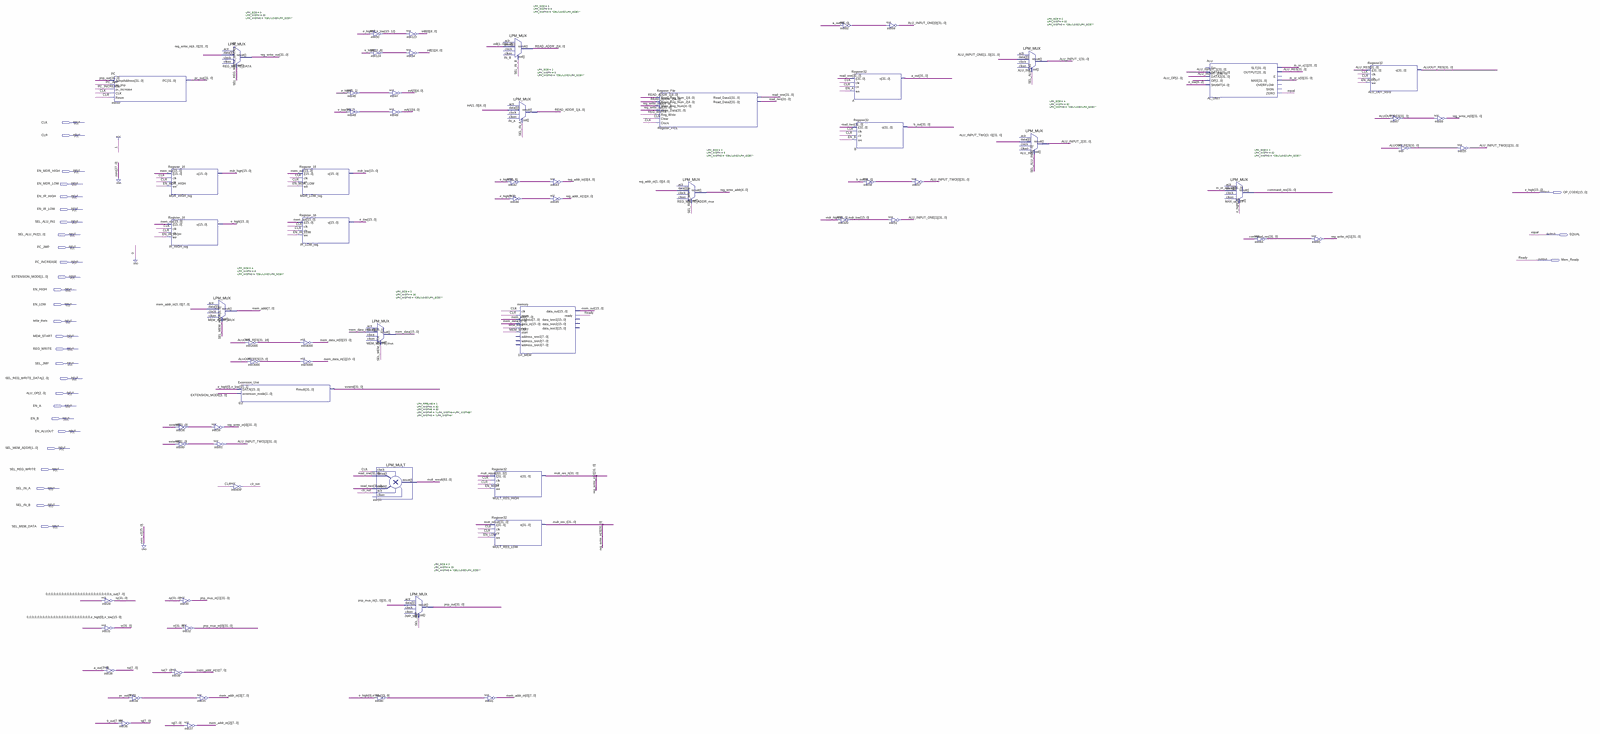
[diagram p0: schematic sheet, whole]
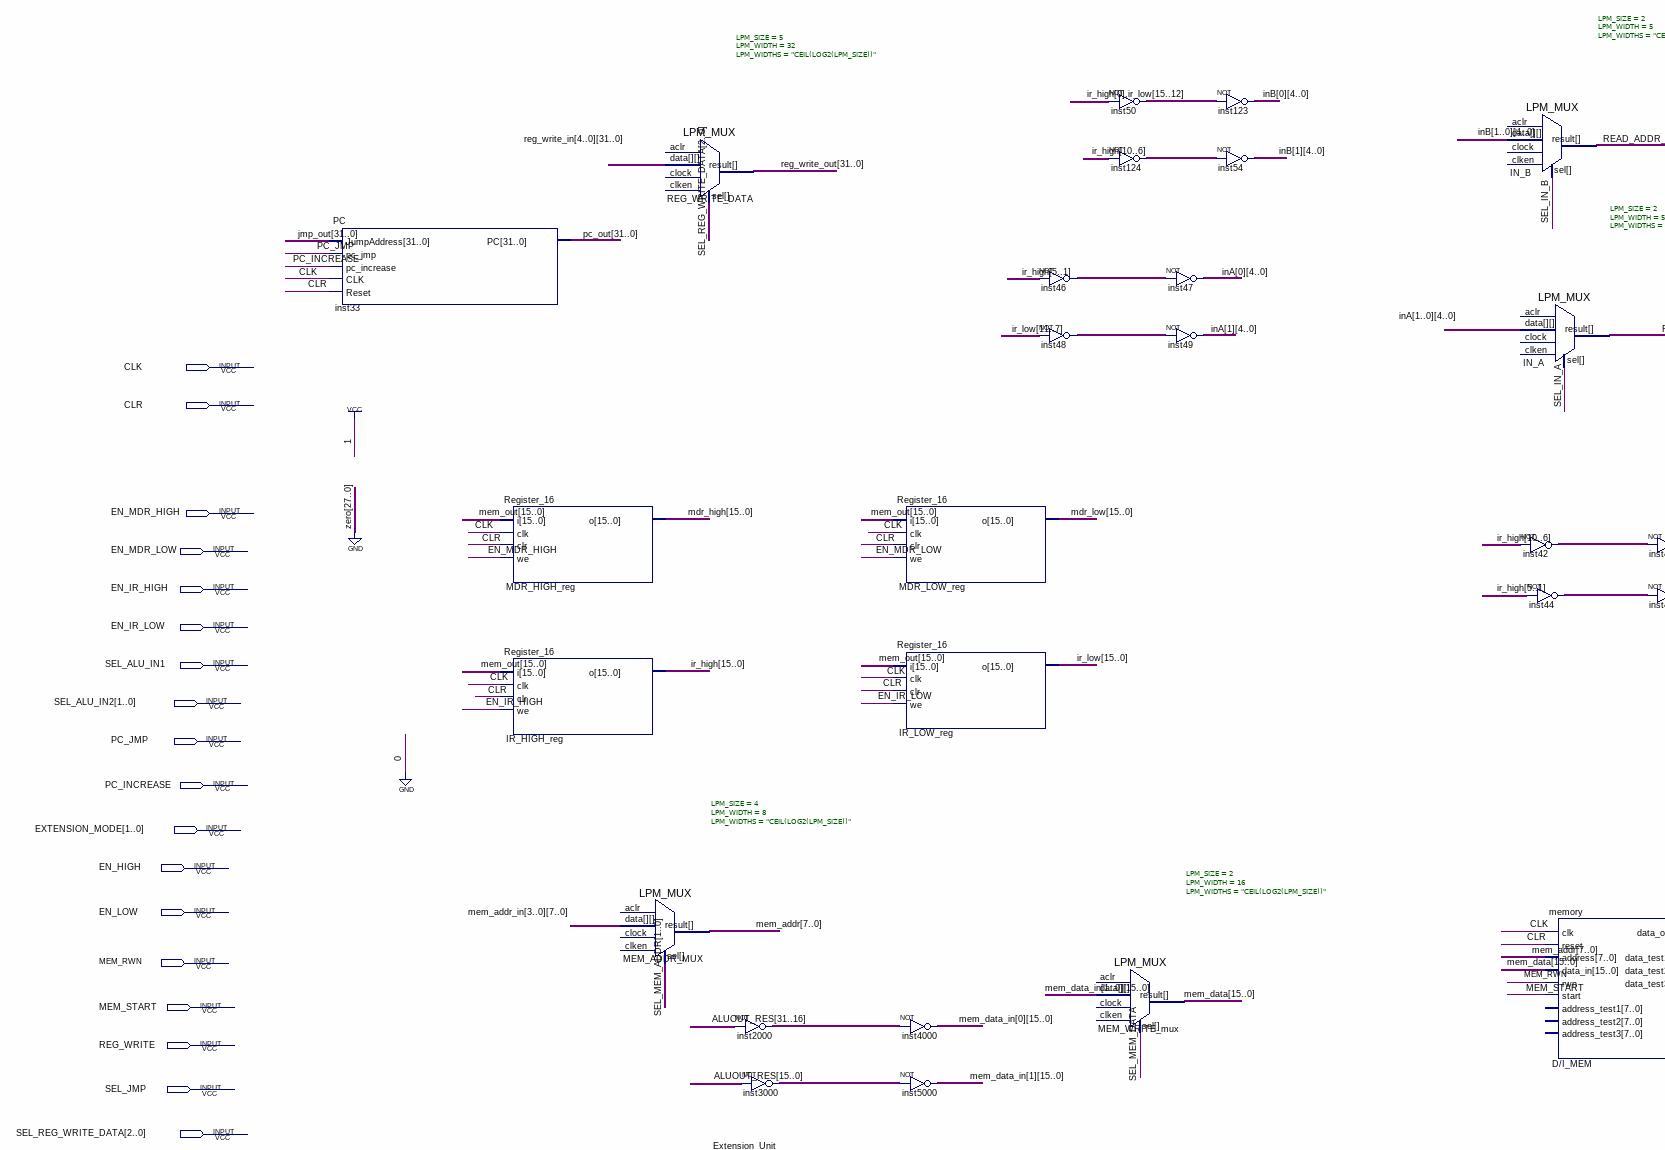
[diagram p1: schematic sheet, upper left part]
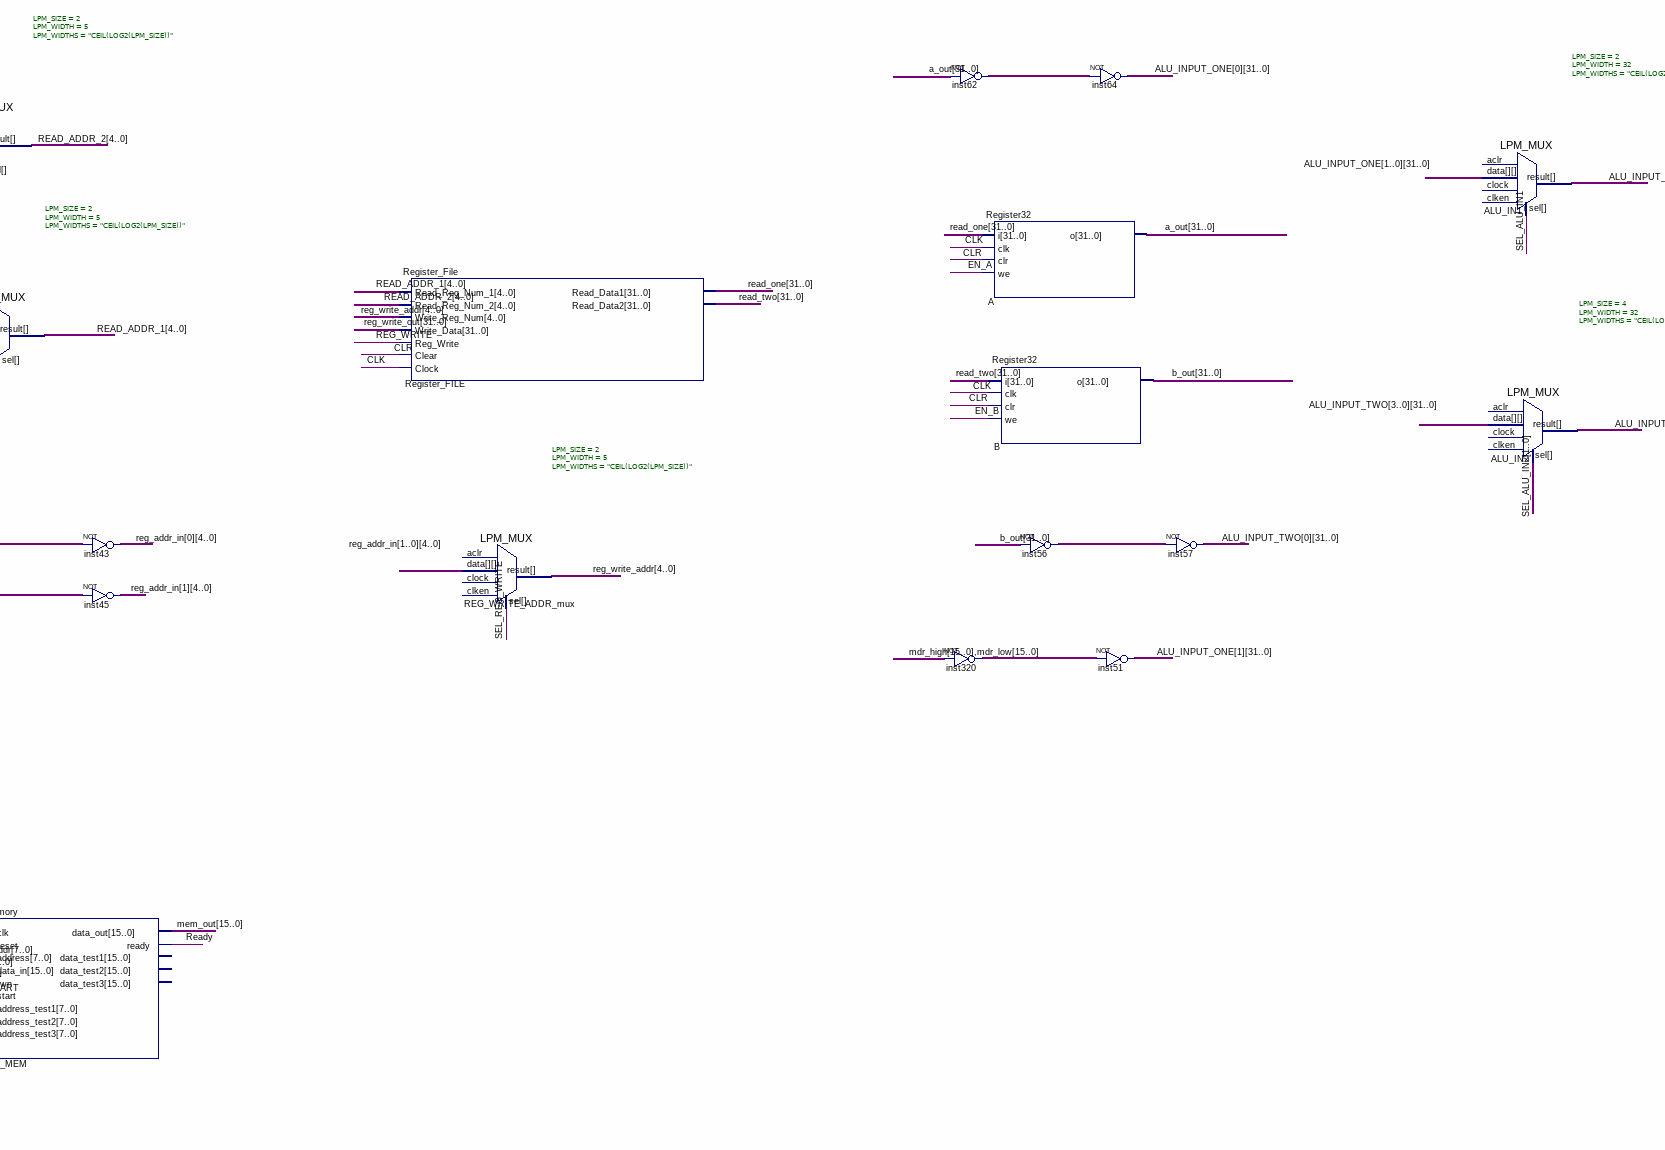
[diagram p2: schematic sheet, upper centre part]
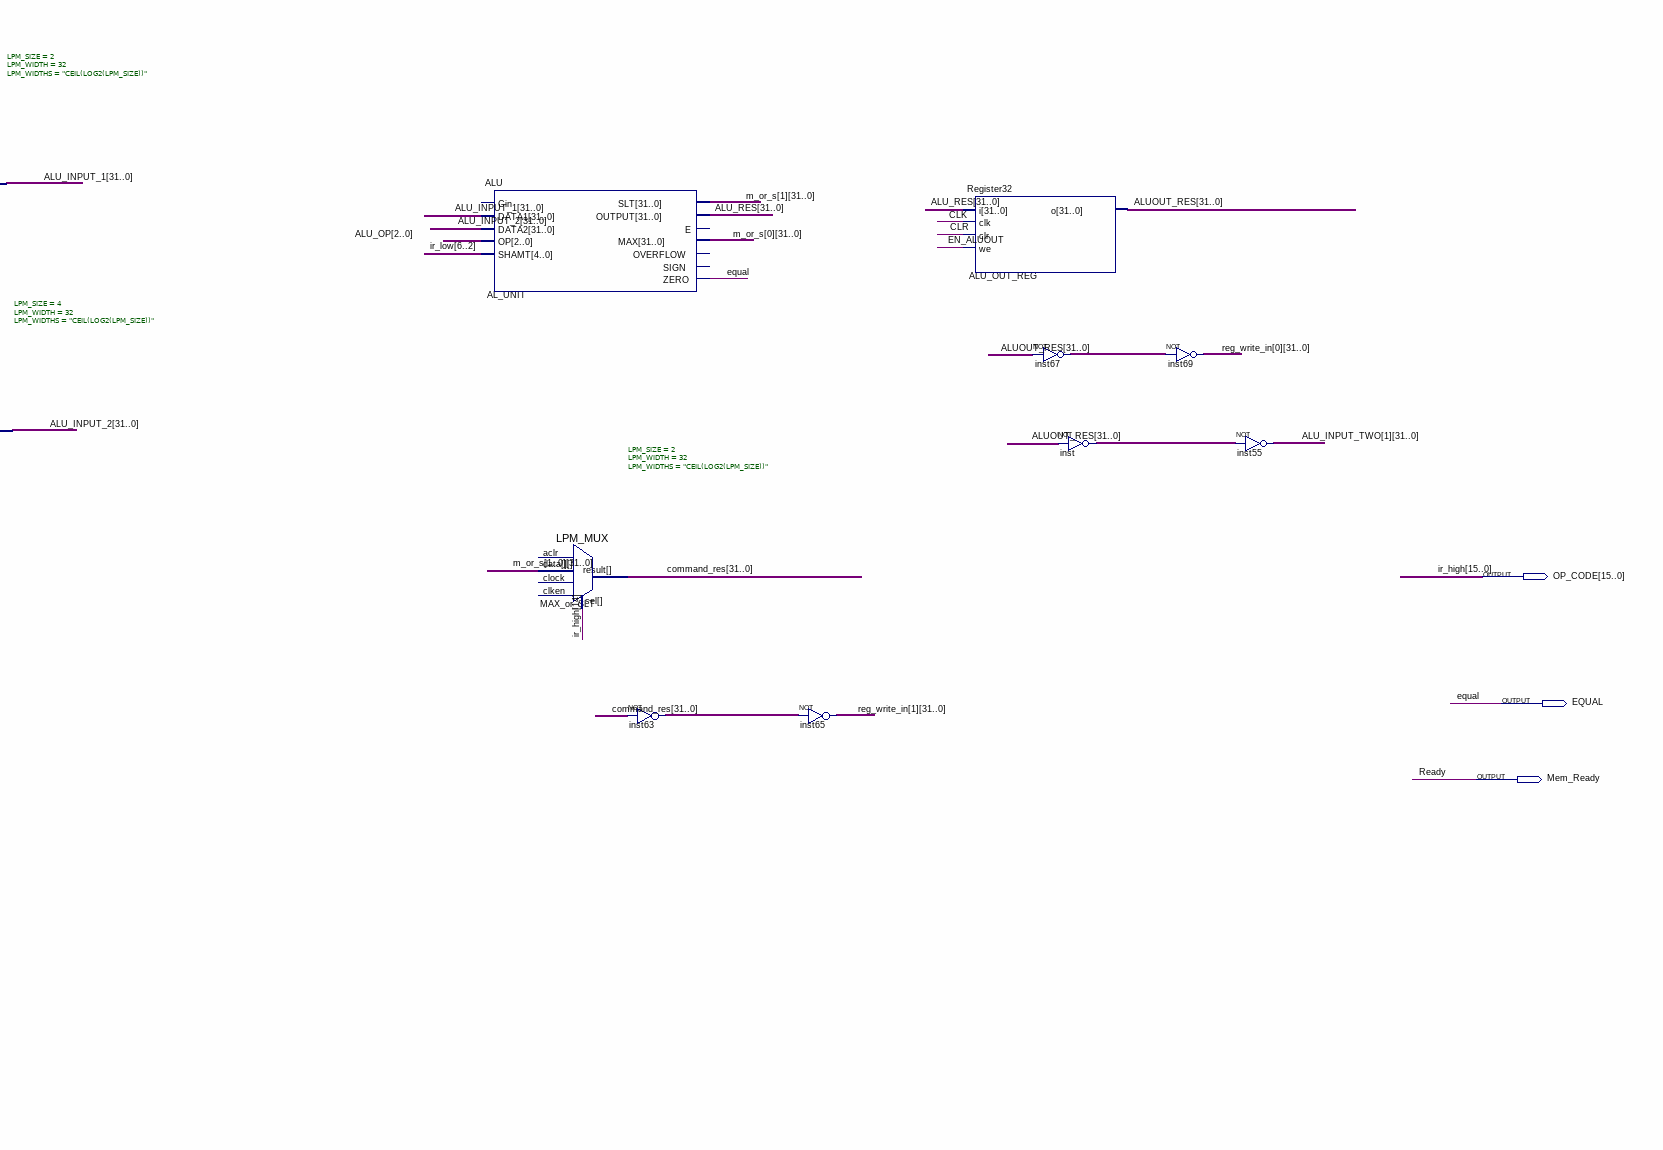
[diagram p3: schematic sheet, upper right part]
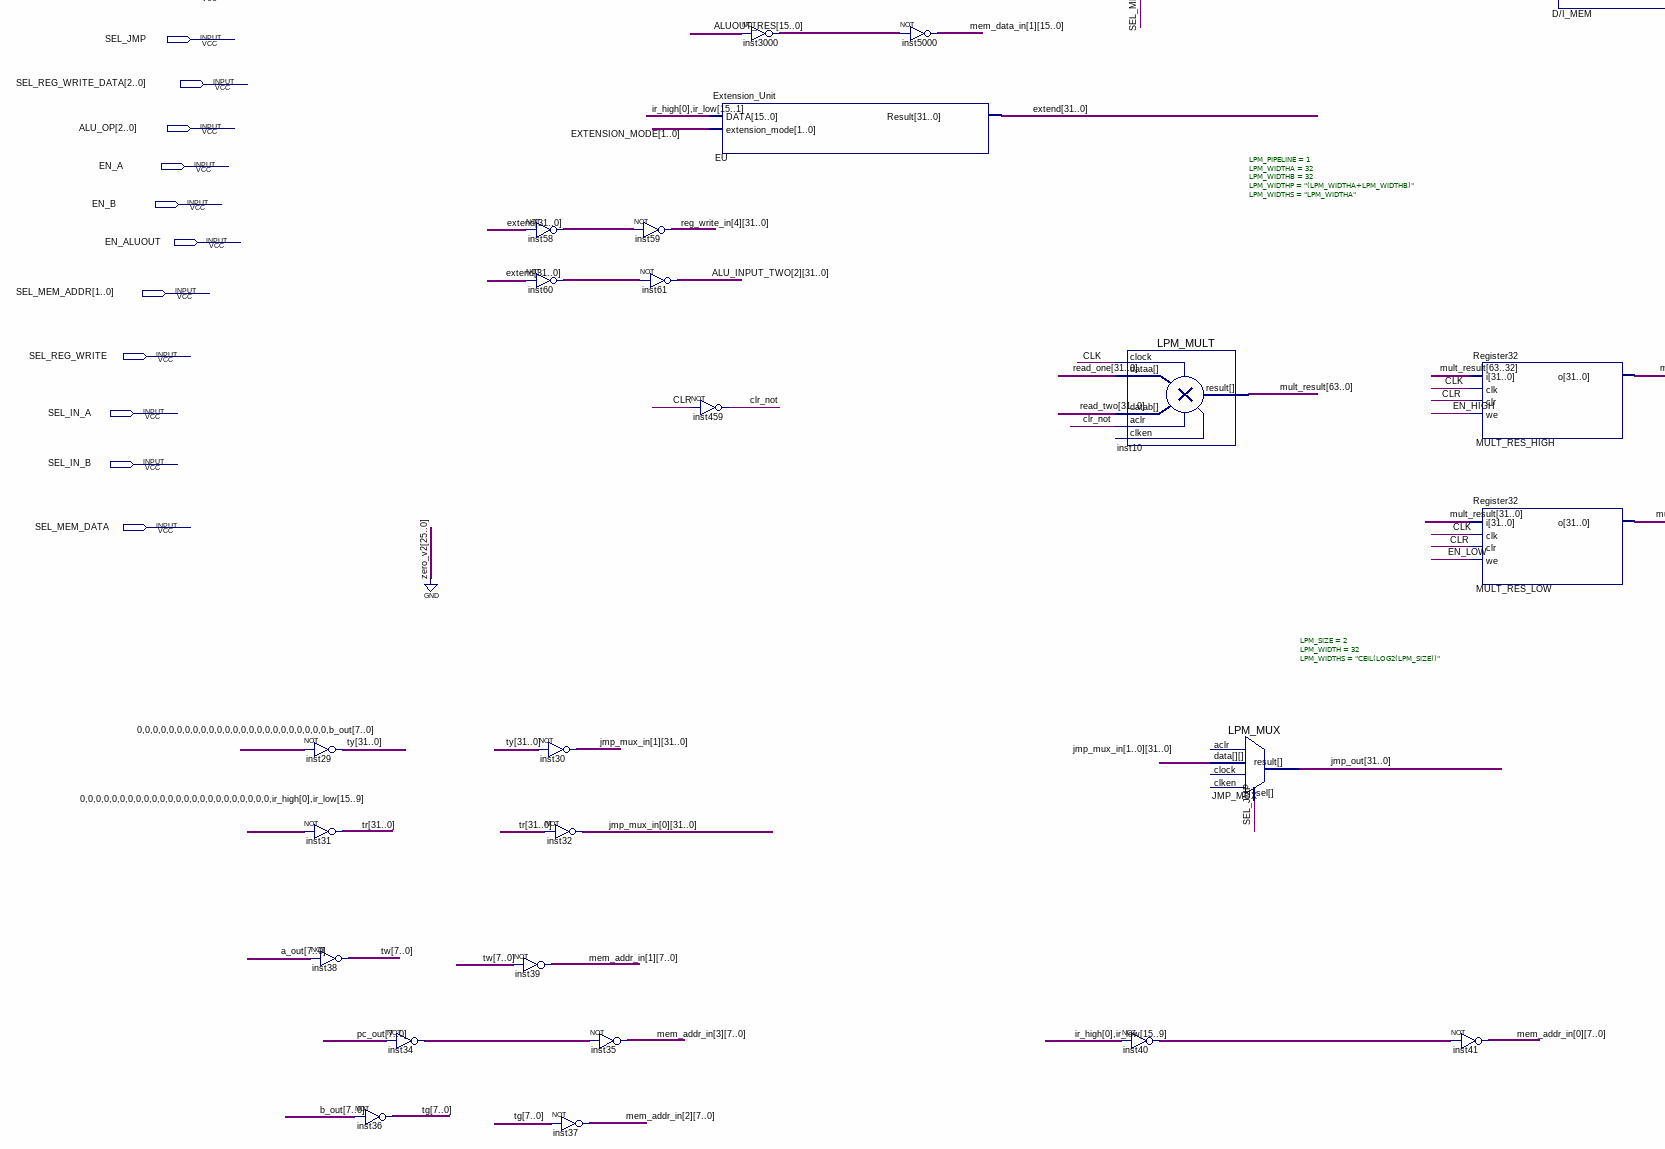
[diagram p4: schematic sheet, lower left part]
// Quartus schematic Data_Path_v2.bdf as structural Verilog: 70 symbols, 30 pins
module Data_Path_v2 (
  input  CLK,
  input  CLR,
  input  EN_MDR_HIGH,
  input  EN_MDR_LOW,
  input  EN_IR_HIGH,
  input  EN_IR_LOW,
  input  SEL_ALU_IN1,
  input  [1:0] SEL_ALU_IN2,
  input  PC_JMP,
  input  PC_INCREASE,
  input  [1:0] EXTENSION_MODE,
  input  EN_HIGH,
  input  EN_LOW,
  input  MEM_RWN,
  input  MEM_START,
  input  REG_WRITE,
  input  SEL_JMP,
  input  [2:0] SEL_REG_WRITE_DATA,
  input  [2:0] ALU_OP,
  input  EN_A,
  input  EN_B,
  input  EN_ALUOUT,
  input  [1:0] SEL_MEM_ADDR,
  input  SEL_REG_WRITE,
  input  SEL_IN_A,
  input  SEL_IN_B,
  input  SEL_MEM_DATA,
  output [15:0] OP_CODE,
  output EQUAL,
  output Mem_Ready
);

  wire clr_not;
  wire [4:0] inA_0, inA_1, inB_0, inB_1, inst42_out, inst44_out, inst46_out, inst48_out, inst50_out,
       inst124_out, READ_ADDR_1, READ_ADDR_2, reg_addr_in_0, reg_addr_in_1, reg_write_addr;
  wire [7:0] inst34_out, inst40_out, mem_addr, mem_addr_in_0, mem_addr_in_1, mem_addr_in_2, mem_addr_in_3,
       tg, tw;
  wire [15:0] inst2000_out, inst3000_out, ir_low, mdr_high, mdr_low, mem_data, mem_data_in_0, mem_data_in_1,
       mem_out;
  wire [31:0] a_out, ALU_INPUT_1, ALU_INPUT_2, ALU_INPUT_ONE_0, ALU_INPUT_ONE_1, ALU_INPUT_TWO_0,
       ALU_INPUT_TWO_1, ALU_INPUT_TWO_2, ALU_INPUT_TWO_3, ALU_RES, ALUOUT_RES, b_out, command_res, extend,
       inst56_out, inst58_out, inst60_out, inst62_out, inst63_out, inst67_out, inst320_out, inst_out,
       jmp_mux_in_0, jmp_mux_in_1, jmp_out, m_or_s_0, m_or_s_1, mult_res_h, mult_res_l, pc_out, read_one,
       read_two, reg_write_in_0, reg_write_in_1, reg_write_in_2, reg_write_in_3, reg_write_in_4,
       reg_write_out, tr, ty;
  wire [63:0] mult_result;

  assign ty = ~{{24{1'b0}}, b_out[7:0]};  // NOT inst29, 32 bits wide
  assign tr = ~{{24{1'b0}}, OP_CODE[0], ir_low[15:9]};  // NOT inst31, 32 bits wide
  PC inst33 (.JumpAddress(jmp_out), .pc_jmp(PC_JMP), .pc_increase(PC_INCREASE), .CLK(CLK), .Reset(CLR), .PC(pc_out));
  assign tw = ~a_out[7:0];  // NOT inst38, 8 bits wide
  assign tg = ~b_out[7:0];  // NOT inst36, 8 bits wide
  assign inst34_out = ~pc_out[7:0];  // NOT inst34, 8 bits wide
  Register_16 MDR_HIGH_reg (.i(mem_out), .clk(CLK), .clr(CLR), .we(EN_MDR_HIGH), .o(mdr_high));
  Register_16 IR_HIGH_reg (.i(mem_out), .clk(CLK), .clr(CLR), .we(EN_IR_HIGH), .o(OP_CODE));
  assign inst58_out = ~extend;  // NOT inst58, 32 bits wide
  assign inst60_out = ~extend;  // NOT inst60, 32 bits wide
  assign jmp_mux_in_1 = ~ty;  // NOT inst30, 32 bits wide
  assign jmp_mux_in_0 = ~tr;  // NOT inst32, 32 bits wide
  assign mem_addr_in_1 = ~tw;  // NOT inst39, 8 bits wide
  assign mem_addr_in_2 = ~tg;  // NOT inst37, 8 bits wide
  assign mem_addr_in_3 = ~inst34_out;  // NOT inst35, 8 bits wide
  LPM_MUX #(.LPM_SIZE(4), .LPM_WIDTH(8), .LPM_WIDTHS("CEIL(LOG2(LPM_SIZE))")) MEM_ADDR_MUX (
    .data({mem_addr_in_3, mem_addr_in_2, mem_addr_in_1, mem_addr_in_0}), .sel(SEL_MEM_ADDR), .result(mem_addr));  // open: clock, aclr, clken
  assign reg_write_in_4 = ~inst58_out;  // NOT inst59, 32 bits wide
  assign ALU_INPUT_TWO_2 = ~inst60_out;  // NOT inst61, 32 bits wide
  LPM_MUX #(.LPM_SIZE(5), .LPM_WIDTH(32), .LPM_WIDTHS("CEIL(LOG2(LPM_SIZE))")) REG_WRITE_DATA (
    .data({reg_write_in_4, reg_write_in_3, reg_write_in_2, reg_write_in_1, reg_write_in_0}),
    .sel(SEL_REG_WRITE_DATA), .result(reg_write_out));  // open: clock, aclr, clken
  Extension_Unit EU (.DATA({OP_CODE[0], ir_low[15:1]}), .extension_mode(EXTENSION_MODE), .Result(extend));
  not inst459 (clr_not, CLR);
  assign inst2000_out = ~ALUOUT_RES[31:16];  // NOT inst2000, 16 bits wide
  assign inst3000_out = ~ALUOUT_RES[15:0];  // NOT inst3000, 16 bits wide
  Register_16 MDR_LOW_reg (.i(mem_out), .clk(CLK), .clr(CLR), .we(EN_MDR_LOW), .o(mdr_low));
  Register_16 IR_LOW_reg (.i(mem_out), .clk(CLK), .clr(CLR), .we(EN_IR_LOW), .o(ir_low));
  assign mem_data_in_0 = ~inst2000_out;  // NOT inst4000, 16 bits wide
  assign mem_data_in_1 = ~inst3000_out;  // NOT inst5000, 16 bits wide
  assign inst46_out = ~OP_CODE[5:1];  // NOT inst46, 5 bits wide
  assign inst48_out = ~ir_low[11:7];  // NOT inst48, 5 bits wide
  assign inst50_out = ~{OP_CODE[0], ir_low[15:12]};  // NOT inst50, 5 bits wide
  assign inst124_out = ~OP_CODE[10:6];  // NOT inst124, 5 bits wide
  LPM_MUX #(.LPM_SIZE(2), .LPM_WIDTH(16), .LPM_WIDTHS("CEIL(LOG2(LPM_SIZE))")) MEM_WRITE_mux (
    .data({mem_data_in_1, mem_data_in_0}), .sel(SEL_MEM_DATA), .result(mem_data));  // open: clock, aclr, clken
  LPM_MULT #(.LPM_PIPELINE(1), .LPM_WIDTHA(32), .LPM_WIDTHB(32), .LPM_WIDTHP("(LPM_WIDTHA+LPM_WIDTHB)"), .LPM_WIDTHS("LPM_WIDTHA")) inst10 (
    .clock(CLK), .dataa(read_one), .datab(read_two), .aclr(clr_not), .result(mult_result));  // open: clken
  assign inA_0 = ~inst46_out;  // NOT inst47, 5 bits wide
  assign inA_1 = ~inst48_out;  // NOT inst49, 5 bits wide
  assign inst40_out = ~{OP_CODE[0], ir_low[15:9]};  // NOT inst40, 8 bits wide
  assign inB_0 = ~inst50_out;  // NOT inst123, 5 bits wide
  assign inB_1 = ~inst124_out;  // NOT inst54, 5 bits wide
  LPM_MUX #(.LPM_SIZE(2), .LPM_WIDTH(32), .LPM_WIDTHS("CEIL(LOG2(LPM_SIZE))")) JMP_MUX (
    .data({jmp_mux_in_1, jmp_mux_in_0}), .sel(SEL_JMP), .result(jmp_out));  // open: clock, aclr, clken
  Register32 MULT_RES_HIGH (.i(mult_result[63:32]), .clk(CLK), .clr(CLR), .we(EN_HIGH), .o(mult_res_h));
  Register32 MULT_RES_LOW (.i(mult_result[31:0]), .clk(CLK), .clr(CLR), .we(EN_LOW), .o(mult_res_l));
  assign mem_addr_in_0 = ~inst40_out;  // NOT inst41, 8 bits wide
  LPM_MUX #(.LPM_SIZE(2), .LPM_WIDTH(5), .LPM_WIDTHS("CEIL(LOG2(LPM_SIZE))")) IN_B (
    .data({inB_1, inB_0}), .sel(SEL_IN_B), .result(READ_ADDR_2));  // open: clock, aclr, clken
  LPM_MUX #(.LPM_SIZE(2), .LPM_WIDTH(5), .LPM_WIDTHS("CEIL(LOG2(LPM_SIZE))")) IN_A (
    .data({inA_1, inA_0}), .sel(SEL_IN_A), .result(READ_ADDR_1));  // open: clock, aclr, clken
  assign inst42_out = ~OP_CODE[10:6];  // NOT inst42, 5 bits wide
  assign inst44_out = ~OP_CODE[5:1];  // NOT inst44, 5 bits wide
  memory \D/I_MEM  (
    .clk(CLK), .reset(CLR), .address(mem_addr), .data_in(mem_data), .rwn(MEM_RWN), .start(MEM_START),
    .data_out(mem_out), .ready(Mem_Ready));  // open: address_test1, address_test2, address_test3, data_test1, data_test2, data_test3
  assign reg_addr_in_0 = ~inst42_out;  // NOT inst43, 5 bits wide
  assign reg_addr_in_1 = ~inst44_out;  // NOT inst45, 5 bits wide
  Register_File Register_FILE (
    .Read_Reg_Num_1(READ_ADDR_1), .Read_Reg_Num_2(READ_ADDR_2), .Write_Reg_Num(reg_write_addr),
    .Write_Data(reg_write_out), .Reg_Write(REG_WRITE), .Clear(CLR), .Clock(CLK), .Read_Data1(read_one),
    .Read_Data2(read_two));
  LPM_MUX #(.LPM_SIZE(2), .LPM_WIDTH(5), .LPM_WIDTHS("CEIL(LOG2(LPM_SIZE))")) REG_WRITE_ADDR_mux (
    .data({reg_addr_in_1, reg_addr_in_0}), .sel(SEL_REG_WRITE), .result(reg_write_addr));  // open: clock, aclr, clken
  assign inst62_out = ~a_out;  // NOT inst62, 32 bits wide
  assign inst320_out = ~{mdr_high, mdr_low};  // NOT inst320, 32 bits wide
  Register32 A (.i(read_one), .clk(CLK), .clr(CLR), .we(EN_A), .o(a_out));
  Register32 B (.i(read_two), .clk(CLK), .clr(CLR), .we(EN_B), .o(b_out));
  assign inst56_out = ~b_out;  // NOT inst56, 32 bits wide
  assign ALU_INPUT_ONE_0 = ~inst62_out;  // NOT inst64, 32 bits wide
  assign ALU_INPUT_ONE_1 = ~inst320_out;  // NOT inst51, 32 bits wide
  assign ALU_INPUT_TWO_0 = ~inst56_out;  // NOT inst57, 32 bits wide
  LPM_MUX #(.LPM_SIZE(2), .LPM_WIDTH(32), .LPM_WIDTHS("CEIL(LOG2(LPM_SIZE))")) ALU_IN1 (
    .data({ALU_INPUT_ONE_1, ALU_INPUT_ONE_0}), .sel(SEL_ALU_IN1), .result(ALU_INPUT_1));  // open: clock, aclr, clken
  LPM_MUX #(.LPM_SIZE(4), .LPM_WIDTH(32), .LPM_WIDTHS("CEIL(LOG2(LPM_SIZE))")) ALU_IN2 (
    .data({ALU_INPUT_TWO_3, ALU_INPUT_TWO_2, ALU_INPUT_TWO_1, ALU_INPUT_TWO_0}), .sel(SEL_ALU_IN2),
    .result(ALU_INPUT_2));  // open: clock, aclr, clken
  ALU AL_UNIT (
    .DATA1(ALU_INPUT_1), .DATA2(ALU_INPUT_2), .OP(ALU_OP), .SHAMT(ir_low[6:2]), .SLT(m_or_s_1),
    .OUTPUT(ALU_RES), .MAX(m_or_s_0), .ZERO(EQUAL));  // open: Cin, E, OVERFLOW, SIGN
  LPM_MUX #(.LPM_SIZE(2), .LPM_WIDTH(32), .LPM_WIDTHS("CEIL(LOG2(LPM_SIZE))")) MAX_or_SLT (
    .data({m_or_s_1, m_or_s_0}), .sel(OP_CODE[14]), .result(command_res));  // open: clock, aclr, clken
  assign inst63_out = ~command_res;  // NOT inst63, 32 bits wide
  assign reg_write_in_1 = ~inst63_out;  // NOT inst65, 32 bits wide
  Register32 ALU_OUT_REG (.i(ALU_RES), .clk(CLK), .clr(CLR), .we(EN_ALUOUT), .o(ALUOUT_RES));
  assign inst67_out = ~ALUOUT_RES;  // NOT inst67, 32 bits wide
  assign inst_out = ~ALUOUT_RES;  // NOT inst, 32 bits wide
  assign reg_write_in_0 = ~inst67_out;  // NOT inst69, 32 bits wide
  assign ALU_INPUT_TWO_1 = ~inst_out;  // NOT inst55, 32 bits wide

  // Other names for the same wires on the sheet: ir_high[15:0] = OP_CODE; Ready = Mem_Ready
endmodule
